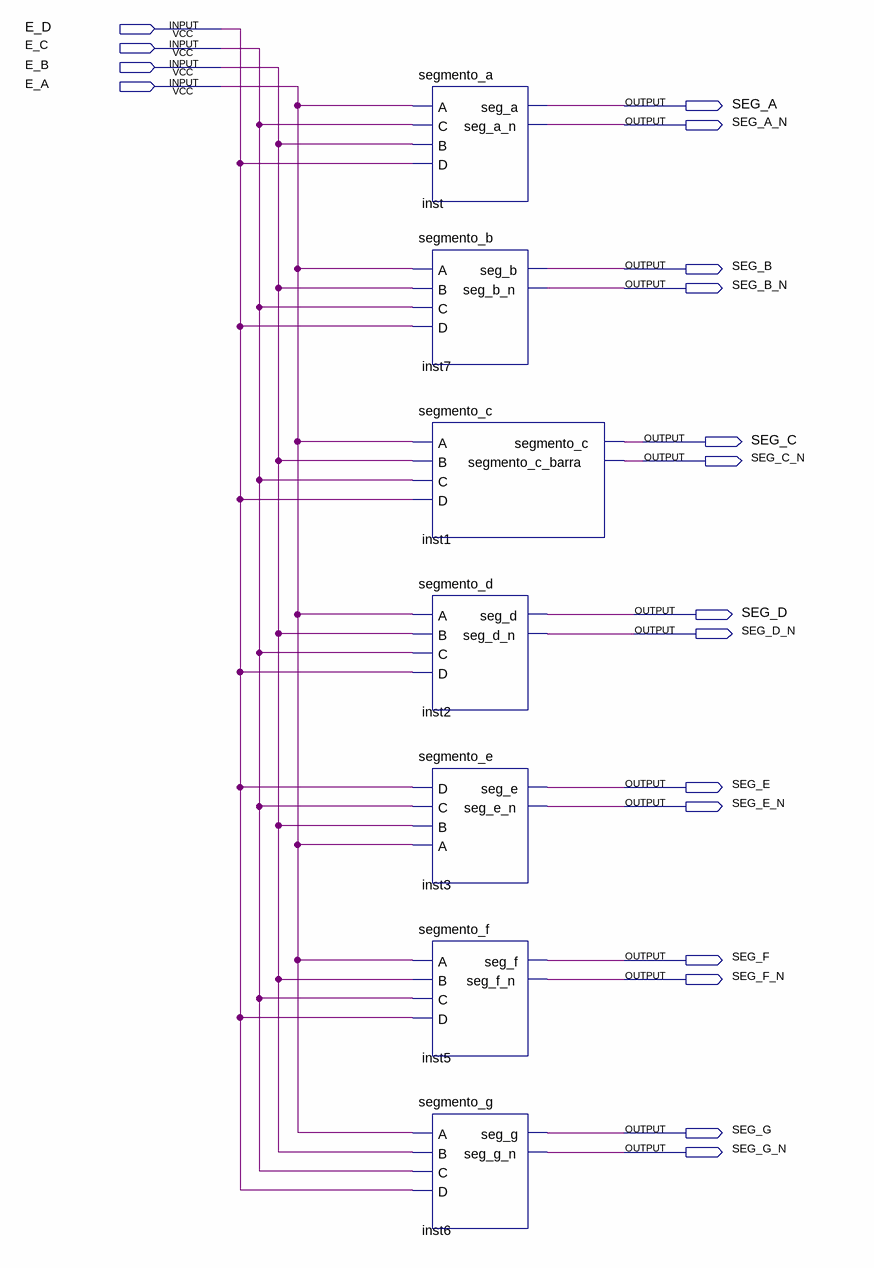
[diagram p0: schematic sheet]
// Quartus schematic decoder.bdf as structural Verilog: 7 symbols, 18 pins
module decoder (
  input  E_D,
  input  E_C,
  input  E_B,
  input  E_A,
  output SEG_A,
  output SEG_A_N,
  output SEG_B,
  output SEG_B_N,
  output SEG_C,
  output SEG_C_N,
  output SEG_D,
  output SEG_D_N,
  output SEG_E,
  output SEG_E_N,
  output SEG_F,
  output SEG_F_N,
  output SEG_G,
  output SEG_G_N
);

  segmento_a inst (.A(E_A), .C(E_C), .B(E_B), .D(E_D), .seg_a(SEG_A), .seg_a_n(SEG_A_N));
  segmento_b inst7 (.A(E_A), .B(E_B), .C(E_C), .D(E_D), .seg_b(SEG_B), .seg_b_n(SEG_B_N));
  segmento_c inst1 (.A(E_A), .B(E_B), .C(E_C), .D(E_D), .segmento_c(SEG_C), .segmento_c_barra(SEG_C_N));
  segmento_d inst2 (.A(E_A), .B(E_B), .C(E_C), .D(E_D), .seg_d(SEG_D), .seg_d_n(SEG_D_N));
  segmento_e inst3 (.D(E_D), .C(E_C), .B(E_B), .A(E_A), .seg_e(SEG_E), .seg_e_n(SEG_E_N));
  segmento_f inst5 (.A(E_A), .B(E_B), .C(E_C), .D(E_D), .seg_f(SEG_F), .seg_f_n(SEG_F_N));
  segmento_g inst6 (.A(E_A), .B(E_B), .C(E_C), .D(E_D), .seg_g(SEG_G), .seg_g_n(SEG_G_N));
endmodule
